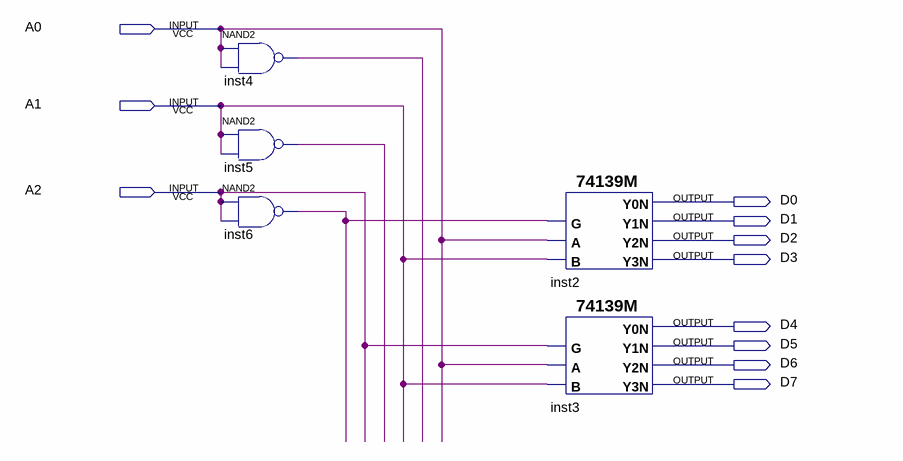
[diagram p0: schematic sheet]
// Quartus schematic lab3_g8_p3_1.bdf as structural Verilog: 5 symbols, 11 pins
module lab3_g8_p3_1 (
  input  A0,
  input  A1,
  input  A2,
  output D0,
  output D1,
  output D2,
  output D3,
  output D4,
  output D5,
  output D6,
  output D7
);

  wire inst4_out, inst5_out, inst6_out;

  nand inst4 (inst4_out, A0, A0);
  nand inst5 (inst5_out, A1, A1);
  nand inst6 (inst6_out, A2, A2);
  \74139M  inst2 (.B(A1), .A(A0), .G(inst6_out), .Y3N(D3), .Y2N(D2), .Y0N(D0), .Y1N(D1));
  \74139M  inst3 (.B(A1), .A(A0), .G(A2), .Y3N(D7), .Y2N(D6), .Y0N(D4), .Y1N(D5));
endmodule
